# Altium schematic sheet main.SchDoc
size A4
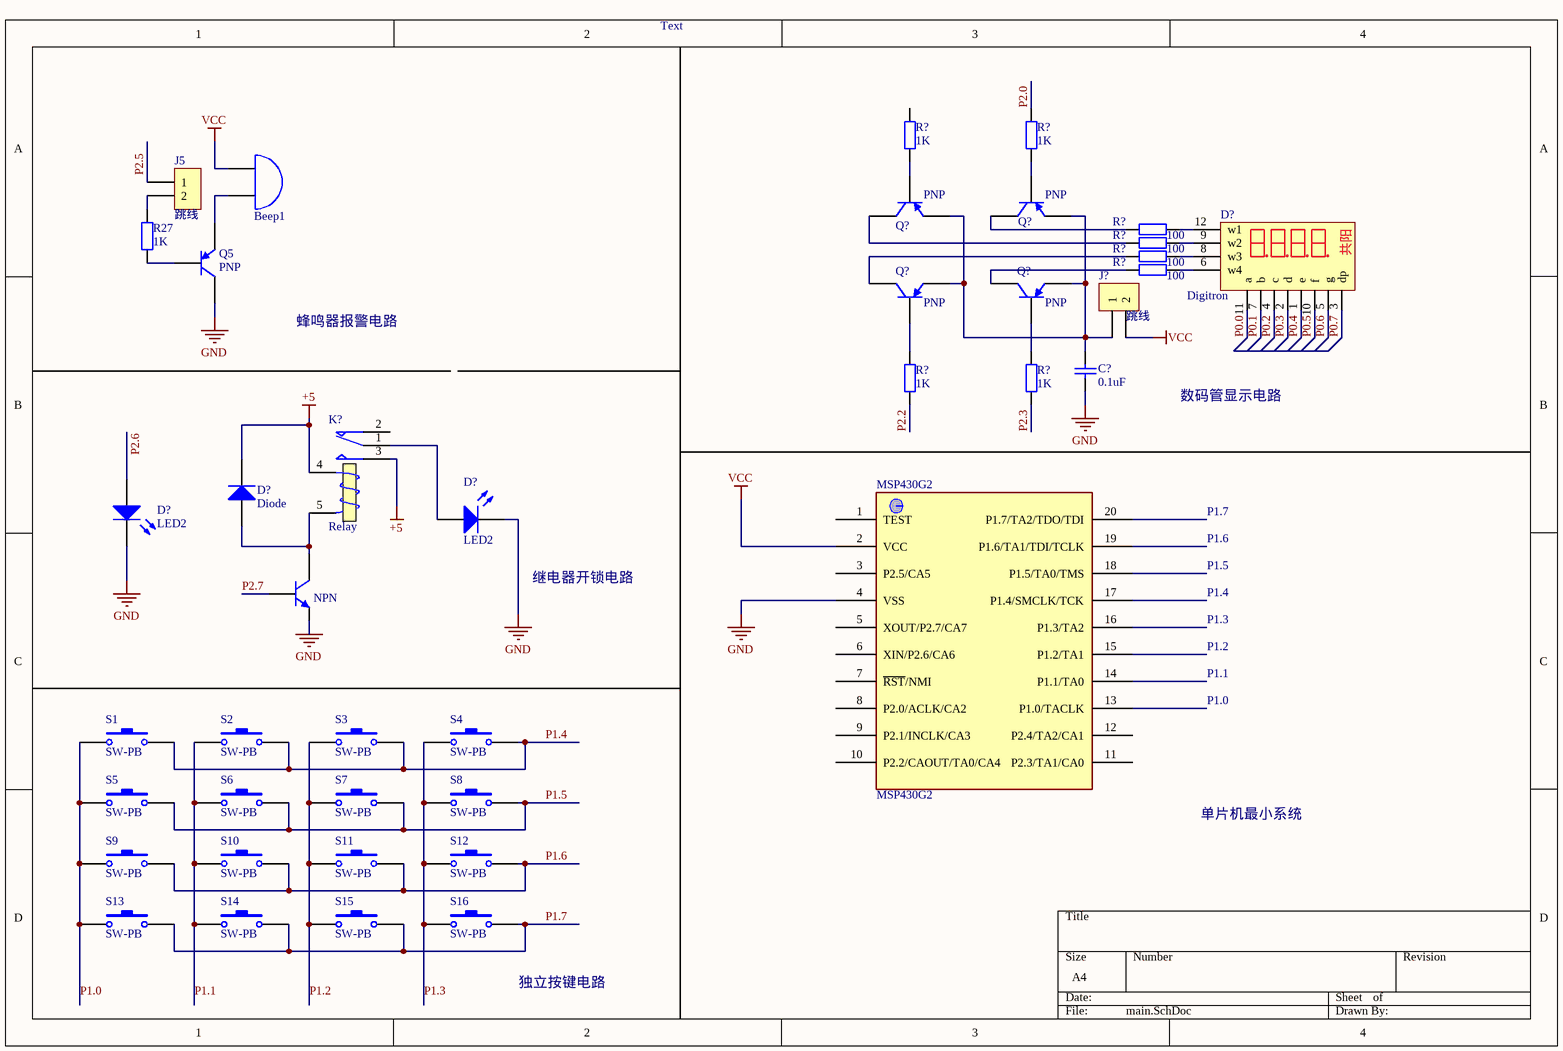
[diagram p0: main.SchDoc]

## Parts
(Parts that share a designator on the sheet are numbered #1, #2 ... from top to bottom, then left to right.)
?  NPN  [TO-226-AA]
Beep1  蜂鸣器  [beep]  (value not drawn)
C?  value 0.1uF  [0805_C]  (hidden comment: Cap_SMT)
D?#1  Digitron  [Ditigron_Pack]
D?#2  Diode  [SMC]
D?#3  LED2  [3.2X1.6X1.1]
D?#4  LED2  [3.2X1.6X1.1]
J5  跳线  [SIP2-0.254]
J?  跳线  [SIP2-0.254]
K?  Relay  [MODULE5B]
MSP430G2  MSP430G2  [DGV20]
Q5  PNP  [SOT-23Q]
Q?#1  PNP  [SOT-23Q]
Q?#2  PNP  [SOT-23Q]
Q?#3  PNP  [SOT-23Q]
Q?#4  PNP  [SOT-23Q]
R27  value 1K  [0805_R]  (hidden comment: Res_SMT)
R?#1  value 1K  [0805_R]  (hidden comment: Res_SMT)
R?#2  value 1K  [0805_R]  (hidden comment: Res_SMT)
R?#3  value 100  [0805_R]  (hidden comment: Res_SMT)
R?#4  value 100  [0805_R]  (hidden comment: Res_SMT)
R?#5  value 100  [0805_R]  (hidden comment: Res_SMT)
R?#6  value 100  [0805_R]  (hidden comment: Res_SMT)
R?#7  value 1K  [0805_R]  (hidden comment: Res_SMT)
R?#8  value 1K  [0805_R]  (hidden comment: Res_SMT)
S1  SW-PB  [SPST-2]
S2  SW-PB  [SPST-2]
S3  SW-PB  [SPST-2]
S4  SW-PB  [SPST-2]
S5  SW-PB  [SPST-2]
S6  SW-PB  [SPST-2]
S7  SW-PB  [SPST-2]
S8  SW-PB  [SPST-2]
S9  SW-PB  [SPST-2]
S10  SW-PB  [SPST-2]
S11  SW-PB  [SPST-2]
S12  SW-PB  [SPST-2]
S13  SW-PB  [SPST-2]
S14  SW-PB  [SPST-2]
S15  SW-PB  [SPST-2]
S16  SW-PB  [SPST-2]

## Nets
+5: D?#2.2(K) K?.3(NO) K?.4(T1)
GND: ?.3(E) C?.1 D?#3.2(K) D?#4.2(K) MSP430G2.4(VSS) Q5.C
VCC: Beep1.2(B) J?.2 MSP430G2.2(VCC)
P0.0: D?#1.11(a)
P0.1: D?#1.7(b)
P0.2: D?#1.4(c)
P0.3: D?#1.2(d)
P0.4: D?#1.1(e)
P0.5: D?#1.10(f)
P0.6: D?#1.5(g)
P0.7: D?#1.3(dp)
P1.0: S1.1 S5.1 S9.1 S13.1
P1.1: S2.1 S6.1 S10.1 S14.1
P1.2: S3.1 S7.1 S11.1 S15.1
P1.3: S4.1 S8.1 S12.1 S16.1
P1.4: S1.2 S2.2 S3.2 S4.2
P1.5: S5.2 S6.2 S7.2 S8.2
P1.6: S9.2 S10.2 S11.2 S12.2
P1.7: S13.2 S14.2 S15.2 S16.2
P2.0: R?#2.2
P2.2: R?#7.1
P2.3: R?#8.1
P2.5: J5.1
P2.6: D?#3.1(A)
P2.7: ?.2(B)
Net?_1: ?.1(C) D?#2.1(A) K?.5(T2)
NetBeep1_1: Beep1.1(A) Q5.E
NetC?_2: C?.2 J?.1 Q?#1.E Q?#2.E Q?#3.E Q?#4.E
NetD?#1_6: D?#1.6(w4) R?#6.2
NetD?#1_8: D?#1.8(w3) R?#5.2
NetD?#1_9: D?#1.9(w2) R?#4.2
NetD?#1_12: D?#1.12(w1) R?#3.2
NetD?#4_1: D?#4.1(A) K?.1(COM)
NetJ5_2: J5.2 R27.2
NetQ5_B: Q5.B R27.1
NetQ?#1_B: Q?#1.B R?#1.1
NetQ?#1_C: Q?#1.C R?#4.1
NetQ?#2_B: Q?#2.B R?#2.1
NetQ?#2_C: Q?#2.C R?#3.1
NetQ?#3_B: Q?#3.B R?#7.2
NetQ?#3_C: Q?#3.C R?#5.1
NetQ?#4_B: Q?#4.B R?#8.2
NetQ?#4_C: Q?#4.C R?#6.1

Not connected (* = marked no-connect by the designer): K? 2(NC); MSP430G2 1(TEST) 3(P2.5/CA5) 5(XOUT/P2.7/CA7) 6(XIN/P2.6/CA6) 7(~{RST}/NMI) 8(P2.0/ACLK/CA2) 9(P2.1/INCLK/CA3) 10(P2.2/CAOUT/TA0/CA4) 11(P2.3/TA1/CA0) 12(P2.4/TA2/CA1) 13(P1.0/TACLK) 14(P1.1/TA0) 15(P1.2/TA1) 16(P1.3/TA2) 17(P1.4/SMCLK/TCK) 18(P1.5/TA0/TMS) 19(P1.6/TA1/TDI/TCLK) 20(P1.7/TA2/TDO/TDI); R?#1 2

## Notes on the sheet
- Text
- 蜂鸣器报警电路
- 数码管显示电路
- P1.7
- 继电器开锁电路
- P1.4
- P1.5
- P1.6
- P1.2
- P1.3
- P1.0
- P1.1
- 单片机最小系统
- 独立按键电路
- (in symbol Digitron) 共阳; .

## Library data of the parts
? = NPN: NPN Bipolar Transistor; Published: 8-Jun-2000; LatestRevisionDate: 17-Jul-2002; LatestRevisionNote: Re-released for DXP Platform.; PackageReference: TO-226-AA; Publisher: Altium Limited; PackageDescription: TO, Flat Index; 3 In-Line, Axial Leads; Body Dia. 4.8mm; Leads 0.55 x 0.51 mm (max); Code_JEDEC: TO-226-AA
C? = Cap_SMT: Capacitor
D?#2 = Diode: Default Diode; Published: 8-Jun-2000; LatestRevisionDate: 17-Jul-2002; LatestRevisionNote: Re-released for DXP Platform.; PackageVersion: Sep-1996; PackageReference: SMC; Publisher: Altium Limited; PackageDescription: DO-214-AB/SMC; 2 C-Bend Leads; Body 7.9 x 5.9 mm, inc. leads (LxW); Code_JEDEC: DO-214-AB
D?#3 D?#4 = LED2: Typical RED, GREEN, YELLOW, AMBER GaAs LED; Published: 8-Jun-2000; LatestRevisionDate: 17-Jul-2002; LatestRevisionNote: Re-released for DXP Platform.; PackageVersion: Feb-2002; PackageReference: 3.2X1.6X1.1; Publisher: Altium Limited; PackageDescription: SM LED; 2 Flat Leads
J5 J? = SIP2-0.254
K? = Relay: SPDT Relay; Published: 8-Jun-2000; LatestRevisionDate: 17-Jul-2002; LatestRevisionNote: Re-released for DXP Platform.; PackageReference: MODULE5B; Publisher: Altium Limited
MSP430G2 = MSP430F2131IDGV
R27 R?#1-R?#8 = Res_SMT: Resistor
S1-S16 = SW-PB: Switch; Published: 24-Mar-1999; LatestRevisionDate: 17-Jul-2002; LatestRevisionNote: Re-released for DXP Platform.; PackageReference: SPST-2; Publisher: Altium Limited; PackageDescription: Switch; 2 Leads